# EAGLE design 0HP OR Gate REV 1 (EAGLE 7.6.0)
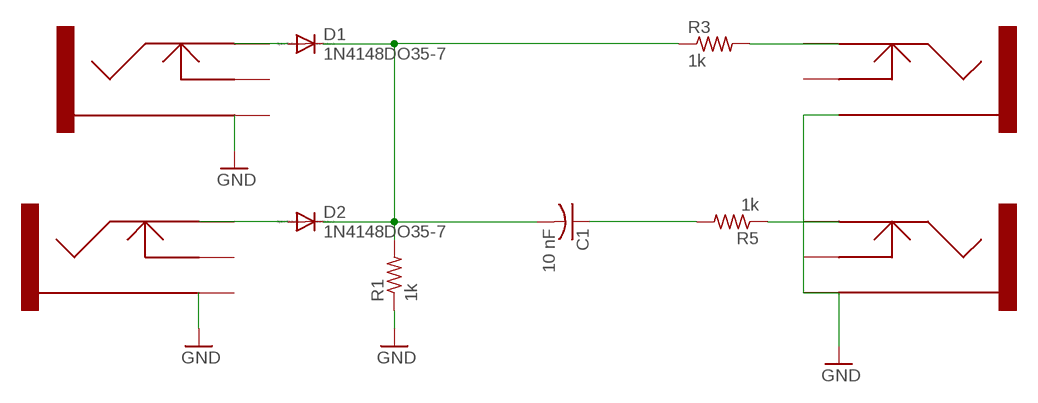
[diagram p0: schematic, sheet 1]

## Parts
C1  10 nF  C-US025-024X044  [C025-024X044]
CV1  3.5MMJACK  [3.5MMPHONEJACK]
CV2  3.5MMJACK  [3.5MMPHONEJACK]
D1  1N4148DO35-7  [DO35-7]
D2  1N4148DO35-7  [DO35-7]
IN  3.5MMJACK  [3.5MMPHONEJACK]
OUT  3.5MMJACK  [3.5MMPHONEJACK]
R1  1k  R-US_0207/2V  [0207/2V]
R3  1k  R-US_0207/2V  [0207/2V]
R5  1k  R-US_0207/2V  [0207/2V]

## Nets
GND: CV1.SLEEVE CV2.SLEEVE IN.SLEEVE OUT.SLEEVE R1.1
N$1: CV2.TIP D1.A
N$4: CV1.TIP D2.A
N$8: C1.1 R5.2
N$9: C1.2 D1.C D2.C R1.2 R3.1
N$10: IN.TIP R5.1
N$11: OUT.TIP R3.2
Unconnected: CV1.SWITCH CV2.SWITCH IN.SWITCH OUT.SWITCH

## Library data of the parts
C1 = rcl:C-US: CAPACITOR, American symbol
CV1 CV2 IN OUT = elipech_modified:3.5MMJACK
D1 D2 = diode:1N4148: DIODE high speed (Philips)
R1 R3 R5 = resistor:R-US_: RESISTOR, American symbol

## Board
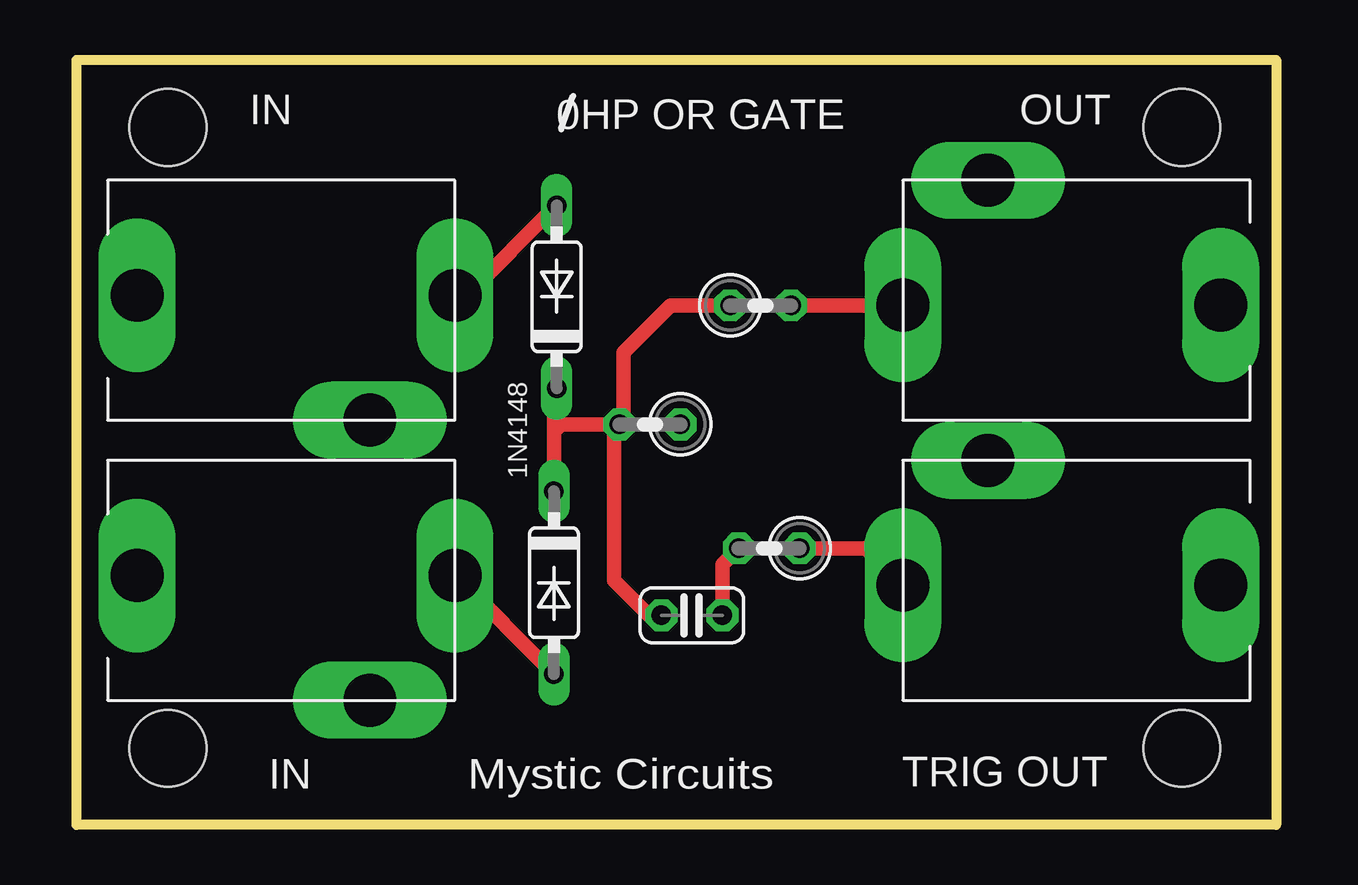
[diagram p1: board, top side]
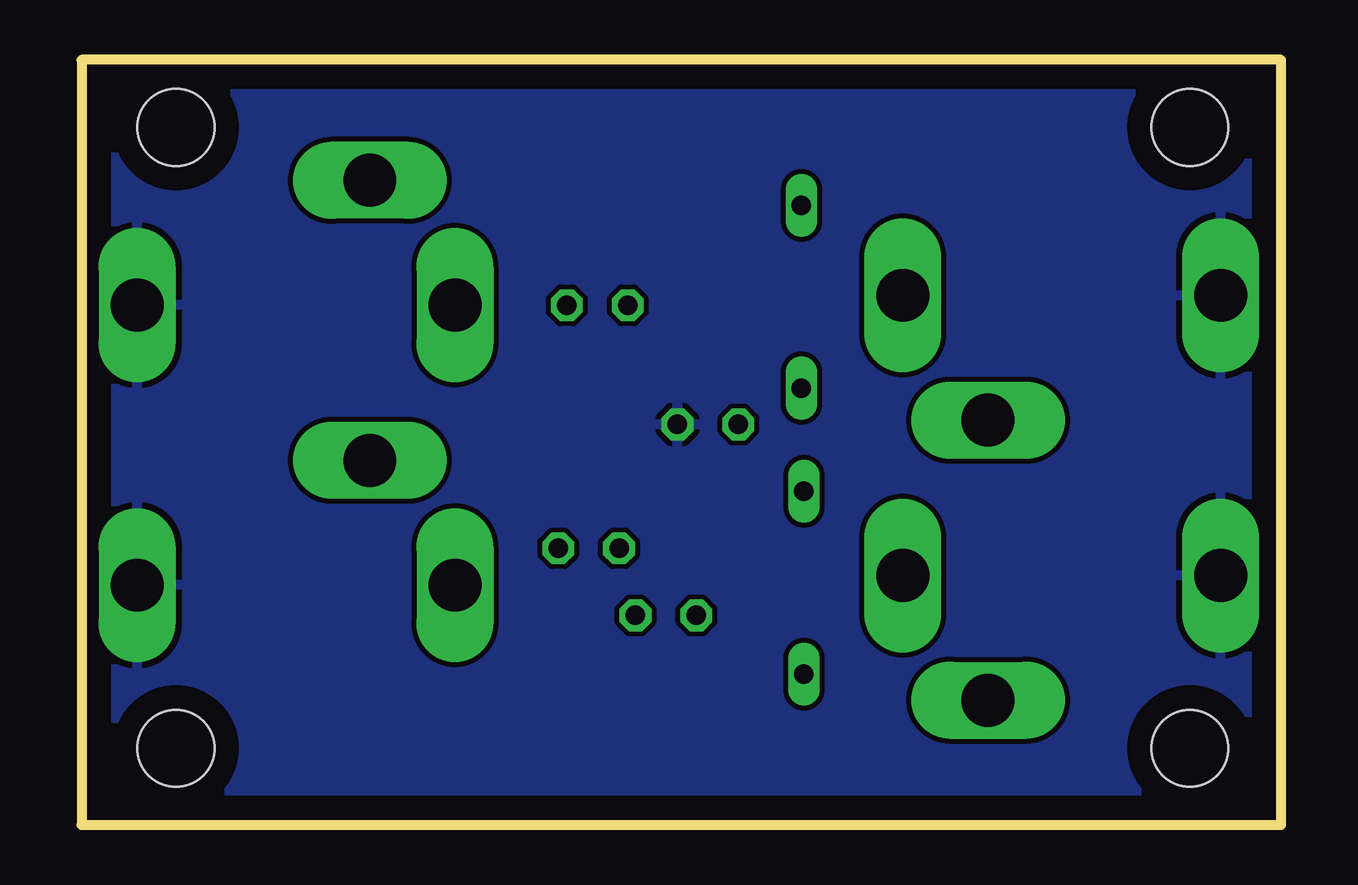
[diagram p2: board, bottom side, seen from below]

Size 50 x 31.89 mm. Coordinates in mm from the lower left corner, seen from the top.
Outline: 0,0 0,31.89 50,31.89 50,0 0,0
Copper layers (1*16): Top 0.035mm / dielectric 1.5mm / Bottom 0.035mm
Design rules "default": minimum track width 10mil, minimum drill 24mil, track to track 8mil, track to pad 8mil, pad to pad 8mil, via to via 8mil, smd to smd 8mil, copper to edge 40mil, drill to drill 8mil, minimum pad ring 10mil, minimum via ring 8mil, stop-mask expansion 4mil, vias tented up to drill 0mil, thermal gap 10mil
Holes 3.2 mm at 3.81,3.2 46.08,3.2 46.08,29.08 3.81,29.08

### Footprints (pad centres in the part's own frame; a part is rotated, then mirrored left to right if it is on the bottom)
C025-024X044 = drill 0.813 octagon: 1 -1.27,0; 2 1.27,0
3.5MMPHONEJACK = drill 2.2 pad 2.54 long: SLEEVE -5,0.2; SWITCH 4.7,-5; TIP 8.25,0.2
DO35-7 = drill 0.813 long: A 3.81,0; C -3.81,0
0207/2V = drill 0.813 octagon: 1 -1.27,0; 2 1.27,0

### Placement (x,y rotation side)
C1  25.65,8.74 180 top
CV1  7.53,10.2 0 top
CV2  7.53,21.88 0 top
D1  20.01,22.02 90 top
D2  19.9,10.1 270 top
IN  42.69,10.2 180 top
OUT  42.69,21.88 180 top
R1  23.9,16.7 180 top
R3  28.51,21.66 0 top
R5  28.87,11.54 180 top

### Tracks (layer width: path | path; a pad name or v marks a point on that pad's centre or on a via)
GND
  pour Bottom: 0.28,0.14 0.1,31.87 50.1,31.62 50,0
N$1
  Top 0.61: CV2.TIP 16.25,22.08 D1.A
N$4
  Top 0.61: CV1.TIP D2.A
N$8
  Top 0.61: C1.1 26.92,10.86 R5.2
N$9
  Top 0.61: D2.C 19.9,16.4 | 19.9,16.4 19.9,18.11 D1.C | R1.2 20.2,16.7 19.9,16.4 | R3.1 24.77,21.66 22.8,19.7 22.8,16.87 R1.2 | C1.2 23.86,8.74 22.4,10.2 22.4,16.47 R1.2
N$10
  Top 0.61: R5.1 32.91,11.54 IN.TIP
N$11
  Top 0.61: R3.2 34.42,21.66 OUT.TIP

### Text on the board
tPlace: IN | 0HP OR GATE | OUT | 1N4148 | IN | Mystic Circuits | TRIG OUT